# EAGLE design Balloon_Cut-Down (EAGLE 9.2.2)

## Sheet 1 of 2
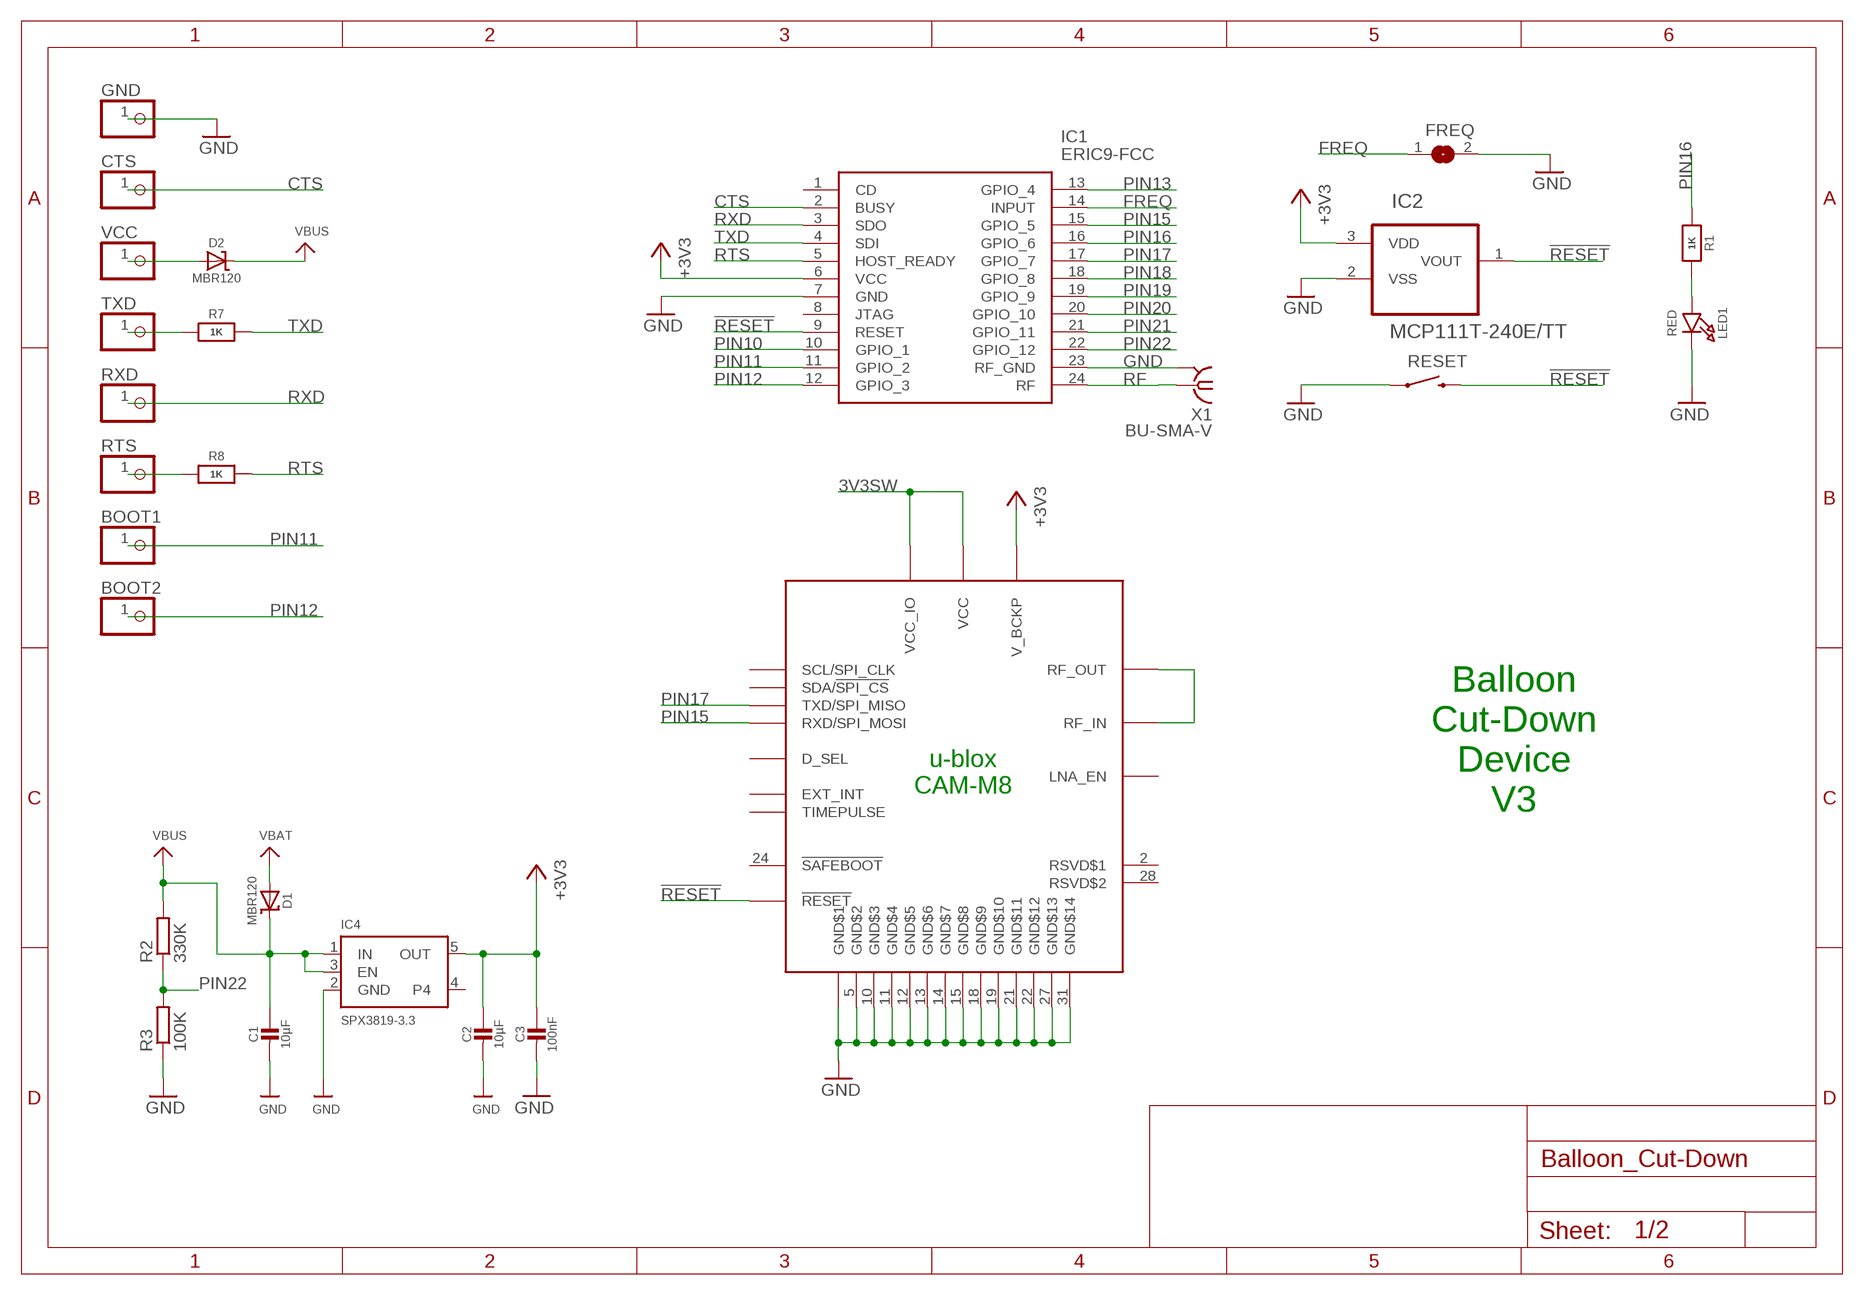
[diagram p0: schematic, sheet 1]

### Parts
BOOT1  PINHD-1X1  [1X01]
BOOT2  PINHD-1X1  [1X01]
C1  10µF  CAP_CERAMIC0805-NOOUTLINE  [0805-NO]
C2  10µF  CAP_CERAMIC0805-NOOUTLINE  [0805-NO]
C3  100nF  CAP_CERAMIC0603_NO  [0603-NO]
CTS  PINHD-1X1  [1X01]
D1  MBR120  DIODE-SCHOTTKYSOD-123  [SOD-123]
D2  MBR120  DIODE-SCHOTTKYSOD-123  [SOD-123]
FREQ  SOLDERJUMPER  [SOLDERJUMPER_ARROW_NOPASTE]
GND  PINHD-1X1  [1X01]
IC1  ERIC9-FCC  [ERIC4]
IC2  MCP111T-240E/TT  MCP111T-270E/TT  [SOT95P237X112-3N]
IC3  CAM-M8  [CAM-M8]
IC4  SPX3819-3.3  VREG_SOT23-5  [SOT23-5]
LED1  RED  LED0805_NOOUTLINE  [CHIPLED_0805_NOOUTLINE]
R1  1K  RESISTOR_0603_NOOUT  [0603-NO]
R2  330K  R-EU_R0603  [R0603]
R3  100K  R-EU_R0603  [R0603]
R7  1K  RESISTOR_0603_NOOUT  [0603-NO]
R8  1K  RESISTOR_0603_NOOUT  [0603-NO]
RESET  SWITCH-MOMENTARY-2PTH  [TACTILE-PTH]
RTS  PINHD-1X1  [1X01]
RXD  PINHD-1X1  [1X01]
TXD  PINHD-1X1  [1X01]
VCC  PINHD-1X1  [1X01]
X1  BU-SMA-V  [BU-SMA-V]

### Nets
3V3SW: IC3.1(VCC_IO) IC3.9(VCC) ; also sheet 2
!RESET: IC1.9(RESET) IC2.1(VOUT) IC3.23(!RESET) RESET.3
+3V3: C2.1 C3.1 IC1.6(VCC) IC2.3(VDD) IC3.8(V_BCKP) IC4.5(OUT) ; also sheet 2
CTS: CTS.1 IC1.2(BUSY) ; also sheet 2
FREQ: FREQ.1 IC1.14(INPUT)
GND: C1.2 C2.2 C3.2 FREQ.2 GND.1 IC1.7(GND) IC1.23(RF_GND) IC2.2(VSS) IC3.4(GND$1) IC3.5(GND$2) IC3.10(GND$3) IC3.11(GND$4) IC3.12(GND$5) IC3.13(GND$6) IC3.14(GND$7) IC3.15(GND$8) IC3.18(GND$9) IC3.19(GND$10) IC3.21(GND$11) IC3.22(GND$12) IC3.27(GND$13) IC3.31(GND$14) IC4.2(GND) LED1.C R3.1 RESET.1 X1.2 X1.3 X1.4 X1.5 ; also sheet 2
N$1: R7.1 TXD.1
N$2: IC3.16(RF_OUT) IC3.17(RF_IN)
N$3: LED1.A R1.2
N$4: R8.1 RTS.1
N$9: D2.A VCC.1
PIN10: IC1.10(GPIO_1) ; also sheet 2
PIN11: BOOT1.1 IC1.11(GPIO_2)
PIN12: BOOT2.1 IC1.12(GPIO_3)
PIN13: IC1.13(GPIO_4) ; also sheet 2
PIN15: IC1.15(GPIO_5) IC3.26(RXD/SPI_MOSI)
PIN16: IC1.16(GPIO_6) R1.1
PIN17: IC1.17(GPIO_7) IC3.25(TXD/SPI_MISO)
PIN18: IC1.18(GPIO_8) ; also sheet 2
PIN19: IC1.19(GPIO_9)
PIN20: IC1.20(GPIO_10)
PIN21: IC1.21(GPIO_11)
PIN22: IC1.22(GPIO_12) R2.1 R3.2
RF: IC1.24(RF) X1.1
RTS: IC1.5(HOST_READY) R8.2 ; also sheet 2
RXD: IC1.3(SDO) RXD.1 ; also sheet 2
TXD: IC1.4(SDI) R7.2 ; also sheet 2
VBAT: D1.A ; also sheet 2
VBUS: C1.1 D1.C D2.C IC4.1(IN) IC4.3(EN) R2.2
Unconnected: IC1.1(CD) IC1.8(JTAG) IC3.2(RSVD$1) IC3.3(SDA/!SPI_CS) IC3.6(SCL/SPI_CLK) IC3.7(EXT_INT) IC3.20(D_SEL) IC3.24(!SAFEBOOT) IC3.28(RSVD$2) IC3.29(TIMEPULSE) IC3.30(LNA_EN) IC4.4

### Notes on the sheet
- u-blox
  CAM-M8
- Balloon
  Cut-Down
  Device
  V3

## Sheet 2 of 2
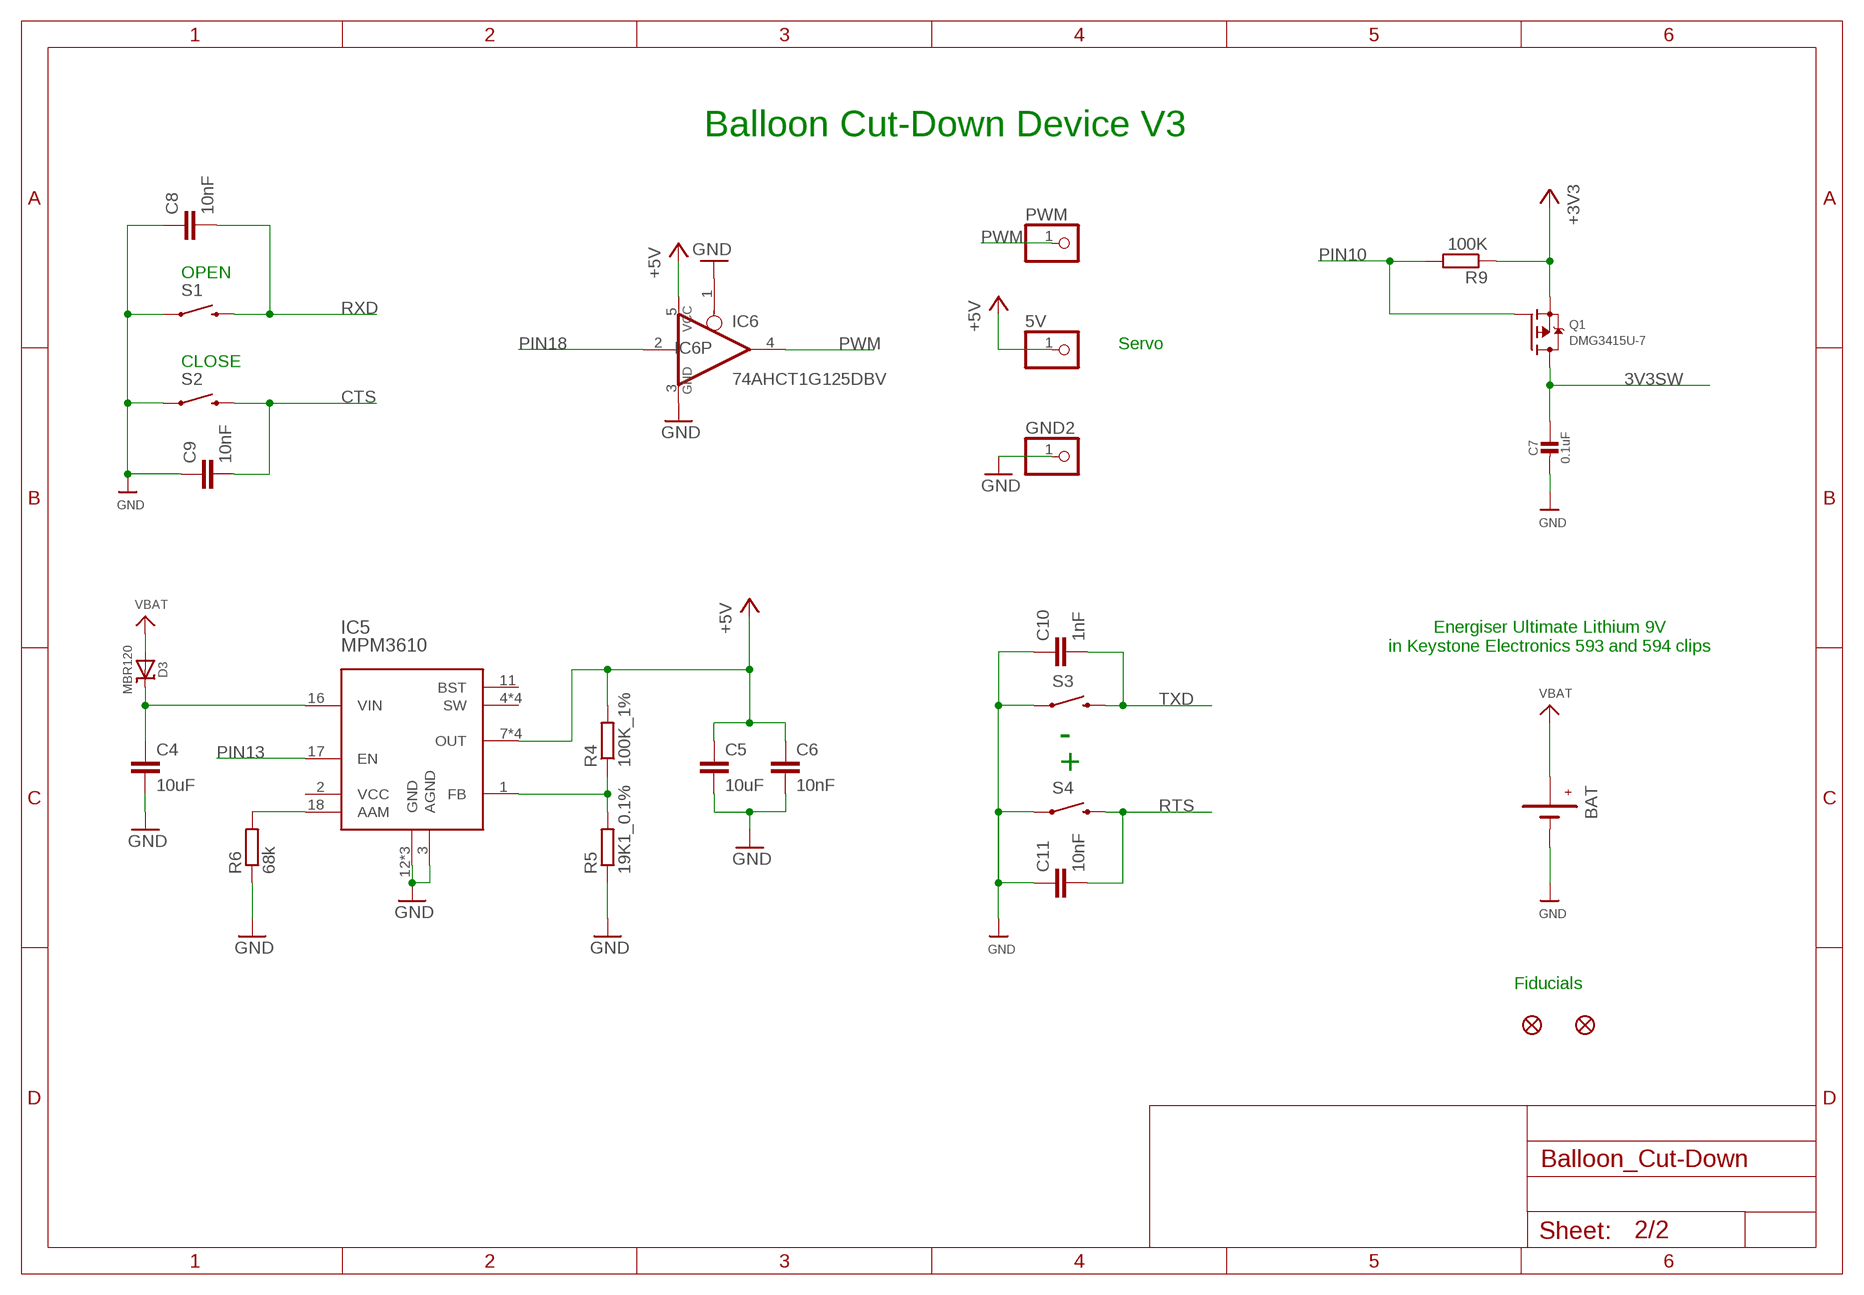
[diagram p1: schematic, sheet 2]

### Parts
5V  PINHD-1X1  [1X01]
BAT  BATTERYBATTERY-9V-KEYSTONE-593-594  [BATTERY-9V-KEYSTONE-593-594]
C4  10uF  C-EUC0805  [C0805]
C5  10uF  C-EUC0805  [C0805]
C6  10nF  C-EUC0805  [C0805]
C7  0.1uF  CAP_CERAMIC0805-NOOUTLINE  [0805-NO]
C8  10nF  C-EUC0805  [C0805]
C9  10nF  C-EUC0805  [C0805]
C10  1nF  C-EUC0805  [C0805]
C11  10nF  C-EUC0805  [C0805]
D3  MBR120  DIODE-SCHOTTKYSOD-123  [SOD-123]
FD1  FIDUCIAL1X2  [FIDUCIAL-1X2]
FD2  FIDUCIAL1X2  [FIDUCIAL-1X2]
GND2  PINHD-1X1  [1X01]
IC5  MPM3610  2093_MPM3610GQV-P  [QFN-20]
IC6  74AHCT1G125DBV  [SOT23-5]
PWM  PINHD-1X1  [1X01]
Q1  DMG3415U-7  MOSFET-PWIDE  [SOT23-WIDE]
R4  100K_1%  R-EU_R0805  [R0805]
R5  19K1_0.1%  R-EU_R0805  [R0805]
R6  68k  R-EU_R0805  [R0805]
R9  100K  R-EU_R0603  [R0603]
S1  SWITCH-MOMENTARY-2PTH  [TACTILE-PTH]
S2  SWITCH-MOMENTARY-2PTH  [TACTILE-PTH]
S3  SWITCH-MOMENTARY-2PTH  [TACTILE-PTH]
S4  SWITCH-MOMENTARY-2PTH  [TACTILE-PTH]

### Nets
3V3SW: C7.1 Q1.3(D) ; also sheet 1
+3V3: Q1.2(S) R9.1 ; also sheet 1
+5V: 5V.1 C5.1 C6.1 IC5.7(OUT) IC5.8(OUT) IC5.9(OUT) IC5.20(OUT) IC6.5(VCC) R4.2
CTS: C9.2 S2.3 ; also sheet 1
GND: BAT.GND1(-) BAT.GND2(-) BAT.GND(-) C4.2 C5.2 C6.2 C7.2 C8.1 C9.1 C10.1 C11.1 GND2.1 IC5.3(AGND) IC5.12(GND) IC5.13(GND) IC5.14(GND) IC6.1(OE) IC6.3(GND) R5.1 R6.1 S1.1 S2.1 S3.1 S4.1 ; also sheet 1
N$6: C4.1 D3.C IC5.16(VIN)
N$26: IC5.1(FB) R4.1 R5.2
N$29: IC5.18(AAM) R6.2
PIN10: Q1.1(G) R9.2 ; also sheet 1
PIN13: IC5.17(EN) ; also sheet 1
PIN18: IC6.2(I) ; also sheet 1
PWM: IC6.4(O) PWM.1
RTS: C11.2 S4.3 ; also sheet 1
RXD: C8.2 S1.3 ; also sheet 1
TXD: C10.2 S3.3 ; also sheet 1
VBAT: BAT.PWR1(+) BAT.PWR2(+) BAT.PWR(+) D3.A ; also sheet 1
Unconnected: IC5.2(VCC) IC5.4(SW) IC5.5(SW) IC5.6(SW) IC5.11(BST) IC5.19(SW)

### Notes on the sheet
- Balloon Cut-Down Device V3
- OPEN
- Servo
- CLOSE
- Energiser Ultimate Lithium 9V
  in Keystone Electronics 593 and 594 clips
- -
- +
- Fiducials

## Library data of the parts
5V BOOT1 BOOT2 CTS GND GND2 PWM RTS RXD TXD VCC = adafruit:PINHD-1X1: Pin header 1x1 for 0.1" spacing With round pins
BAT = SparkFun-Electromechanical:BATTERY: Battery Holders Various common sizes : AA, AAA, 18650 (PRT-12895), 20mm coin cell and 12mm coin cell. 20MM_4LEGS, BATT-10373
C1-C3 C7 = microbuilder:CAP_CERAMIC: Ceramic Capacitors For new designs, use the packages preceded by an '_' character since they are more reliable: The following footprints should be used on most boards: _0402 - Standard footprint for regular board layouts _0603 - Standard footprint for regular board layouts _0805 - Standard footprint for regular board layouts _1206 - Standard footprint for regular board layouts For extremely tight-pitch boards where space is at a premium, the following 'micro-pitch' footprints can be used (smaller pads, no silkscreen outline, etc.): _0402MP - Micro-pitch footprint for very dense/compact boards _0603MP - Micro-pitch footprint for very dense/compact boards _0805MP - Micro-pitch footprint for very dense/compact boards _1206MP - Micro-pitch footprint for very dense/compact boards
C4-C6 C8-C11 = rcl:C-EU: CAPACITOR, European symbol; SPICEPREFIX: C
D1-D3 = microbuilder:DIODE-SCHOTTKY
FD1 FD2 = SparkFun-Aesthetics:FIDUCIAL: Fiducial Alignment Points Various fiducial points for machine vision alignment.
FREQ = microbuilder:SOLDERJUMPER: SMD Solder JUMPER Solder the two pads together to create a connection, or remove the solder to break it. REFLOW - Use this footprint for solder paste and reflow ovens. WAVE - Use this footprint for hand-soldering (larger pads). CLOSED - Has a trace between the two pads to ensure it is closed by default. The trace needs to be cut to disable the jumper, and can be closed again by creating a solder bridge between the two pads.; BOM: EXCLUDE
IC1 = SamacSys_Parts:ERIC9-FCC: RF Modules Euro/US 868/915MHz Int Cont Trans RFMod Source: Datasheet <https://componentsearchengine.com/Datasheets/1/eRIC9-FCC.pdf>; ARROW_PART_NUMBER: eRIC9-FCC; DESCRIPTION: RF Modules Euro/US 868/915MHz Int Cont Trans RFMod; HEIGHT: mm; MANUFACTURER_NAME: LPRS; MANUFACTURER_PART_NUMBER: eRIC9-FCC
IC2 = Microchip-MCP11:MCP11: Micropower Voltage Detector ,SOT23-3;; MPN: MCP111T-240E/TT; OC_FARNELL: 1851877; OC_NEWARK: 56J7328; PACKAGE: SOT23-3; SUPPLIER: MICROCHIP
IC3 = ubloxLib:CAM-M8: CAM-M8x: M8 Concurrent GNSS Antenna Module u-blox.com
IC4 = microbuilder:VREG_SOT23-5: SOT23-5 Fixed Voltage Regulators Part Current Out V Out V In V Dropout θJA (°C/W) TJ (°C) Digikey Part No. ADP121 150mA 3.3V 3.4-5.5V 0.09V @ 150mA -- -- ADP121-AUJZ33R7CT-ND ADP121 150mA 3.0V 3.1-5.5V 0.09V @ 150mA -- -- ADP121-AUJZ30R7CT-ND ADP122 300mA 3.3V 3.4-5.5V 0.085V @ 300mA -- -- ADP122AUJZ-3.3-R7CT-ND ADP1712 300mA 3.3V 3.5-5.5V 0.17V @ 300mA -- -- ADP1712AUJZ-3.3-R7TR-ND AP7311 (Low Cost) 150mA 3.3V 3.5-6V 0.15V @ 150mA -- -- AP7311-33WG-7DICT-ND LD39015M18R 150mA 1.8V 1.9V-5.5V 0.08V @ 100mA -- -- 497-6977-1-ND LP2985A-33DBVR 150mA 3.3V 3.3-16V 0.28V @ 150mA 206 150 296-18479-1-ND MCP1824T-3302E/OT 300mA 3.3V 3.5V-6V 0.2V @ 300mA -- -- MCP1824T-3302E/OTCT-ND MIC5205-2.5YM5 TR 150mA 2.5V 2.7-16V 0.165V @ 150mA -- -- 576-1257-2-ND MIC5205-3.0YM5 TR 150mA 3.0V 3.2V-16V 0.165V @ 150mA -- -- 576-1258-2-ND MIC5205-3.3YM5 TR 150mA 3.3V 3.5V-16V 0.165V @ 150mA -- -- 576-1259-2-ND TPS780330220 150mA 3.3V+2.2V 3.6-5.5V 250mV Max -- -- 296-23332-1-ND TDA3663/N1,135 100mA 3.3V 3.5-45V 0.18V @ 50mA -- -- 568-5343-1-ND Max operating temp can be calculated using θJA, TJ (max junction temperature), and power in watts. Set the "Maximum Ambient Temperature" until it reaches TJ ("Max Junction Temperature"), which is the absolute limit for safe use of the regulator: Heat Sink Temperature Calculator <http://www.daycounter.com/Calculators/Heat-Sink-Temperature-Calculator.phtml> For example, With 12V source into a 3.3V LP2985 and a 30mA load, we are dissipating (12V-3.3V) * 0.03A = 0.261W. With a θJA of 206 °C/W, a TJ of 150°C, and 261mW we can safely use the chip without a heat sink up to 75°C (=147.1°C Junction Temperature).
IC5 = IntegratedCircuits:2093_MPM3610GQV-P: MPM3610 Step Down Regulator; CASE: QFN-20; PART_NUMBER: MPM3610GQV-P; TYPE: Circuito_Integrato
IC6 = 74xx-little-us:74*1G125: Single Bus Buffer Gate with 3-State Output
LED1 = microbuilder:LED: LED 0603 - 0603 Surface Mount Package 2mA: Green LED - Low Power (3.9mcd, 2ma, 1.7Vf) - Digikey: 475-2709-2-ND Orange LED - Low Power (9.8mcd, 2ma, 1.8Vf) - Digikey: 475-1194-2-ND Red LED - Low Power (5mcd, 2ma, 1.8Vf) - Digikey: 475-1195-2-ND Yellow LED - Low Power (7mcd, 2ma, 1.8Vf) - Digikey: 475-1196-2-ND 5mA: Blue LED - Low Power (17mcd, 5ma, 2.9Vf) - Digikey: LNJ937W8CRACT-ND 0805 - 0805 Surface Mount Package 2mA: Red LED (8.8mcd, 2mA, 1.8Vf, Clear) - Low Power [Digikey: 475-2510-1-ND] Green LED (5mcd, 2mA, 1.8Vf, Clear) - Low Power [Digikey: 475-2730-1-ND] Yellow LED (11.3mcd, 2mA, 1.8Vf, Clear) - Low Power [Digikey: 475-2555-1-ND] 20mA: Red LED (104mcd, 20mA, Diffused) - LS R976 [Digikey: 475-1278-6-ND] Red LED (12mcd, 20mA, 2.0Vf, Clear) - APT2012EC [Digikey: 754-1128-1-ND] Green LED (15mcd, 20mA, 2.2Vf, Clear) - APT2012GC [Digikey: 754-1131-1-ND] Orange LED (160mcd, 20mA, 2.1Vf, Clear) - APT2012SECK [Digikey: 754-1130-1-ND] 1206 - 1206 Surface Mount Package Green LED (26mcd, 20mA, Diffused) - LG N971 [Digikey: 475-1407-6-ND] Red LED (15mcd, 20mA, Diffused) - LH N974 [Digikey: 475-1416-6-ND] Cree - Cree High-Power Surface Mount LEDs XPEBWT-L1-0000-00D50 - White 111lm 350mA 2.9Vf 6200K 110° XTEAWT-00-0000-00000LEE3 - White 114lm 350mA 2.85Vf 5000K 115° Everlight - Everlight 45-21 Series Surface Mount LEDs 45-21/QK2C-B2832AC2CB2/2T - Warm White 2000mcd 20mA 3.25Vf 3050K 120° 45-21/LK2C-B38452C4CB2/2T - Nuetral White 2000mcd 20mA 3.25Vf 4150K 120° 45-21/LK2C-B50634C6CB2/2T - Cold White 2200mcd 20mA 3.25Vf 5650K 120° PLCC2 Reverse Mount LS T77K-J1L2-1-0-2-R18-Z - Red 11.25mcd 2mA 1.8Vf 630nm 120° LO T77K-L1M2-24-Z - Orange 19.6mcd 2mA 1.8Vf 606nm 120° LY T77K-K2M1-26-Z - Yellow 15.7mcd 2mA 1.8Vf 587nm 120°
Q1 = microbuilder:MOSFET-P: P-Channel Mosfet LEGEND VDS: Voltage Drain-Source ID: Drain Current RDS(ON): Drain-Source On-State Resistance VGS(TH): Gate-Source Threshold Voltage CISS: Drain-Source Input Capacitance SOT-23 Name VDS ID RDS(ON) VGS(TH) CISS Order Number IRLML5103 30V 760mA 600 mOhm -- 75pF @ 25V Digikey: IRLML5103PBFCT-ND IRLML6401 12V 4.3A 50 mOhm 950mV @ 250µA 830pF @ 10V Digikey: IRLML6401PBFTR-ND NTR0202PL 20V 400mA 800 mOhm 2.3V @ 250uA 70pF @ 5V Digikey: NTR0202PLT1GOSTR-ND NTR4101PT1G 20V 1.8A 85 mOhm 1.2V @ 250uA 675pF @ 10V Digikey: NTR4101PT1GOSCT-ND DMP2004K 20V 600mA 900 mOhm 1V @ 250uA 175pF @ 16V Digikey: DMP2004KDICT-ND PMV65XP 20V 3.9A 76 mOhm 950mV @ 1mA 725pF @ 20V Digikey: 568-2358-2-ND TO-252 Name VDS ID RDS(ON) VGS(TH) CISS Order Number AOD417 30V 25A 34 mOhm 3V @ 250µA 920pF @ 15V Digikey: 785-1106-2-ND
R1 R7 R8 = microbuilder:RESISTOR: Resistors For new designs, use the packages preceded by an '_' character since they are more reliable: The following footprints should be used on most boards: _0402 - Standard footprint for regular board layouts _0603 - Standard footprint for regular board layouts _0805 - Standard footprint for regular board layouts _1206 - Standard footprint for regular board layouts For extremely tight-pitch boards where space is at a premium, the following 'micro-pitch' footprints can be used (smaller pads, no silkscreen outline, etc.): _0402MP - Micro-pitch footprint for very dense/compact boards _0603MP - Micro-pitch footprint for very dense/compact boards _0805MP - Micro-pitch footprint for very dense/compact boards _1206MP - Micro-pitch footprint for very dense/compact boards
R2-R6 R9 = rcl:R-EU_: RESISTOR, European symbol; SPICEPREFIX: R
RESET S1-S4 = SparkFun-Electromechanical:SWITCH-MOMENTARY-2: Various NO switches- pushbuttons, reed, etc; PROD_ID: SWCH-08441
X1 = con-coax:BU-SMA-V: FEMALE SMA CONNECTOR Radiall distributor RS 112-3794; OC_FARNELL: unknown; OC_NEWARK: unknown

## Net classes
2 gnd: width 0.254 mm, drill 0.254 mm, clearance 0.178 mm
3 usbvcc: width 0.203 mm, drill 0.406 mm, clearance 0.178 mm

## Board
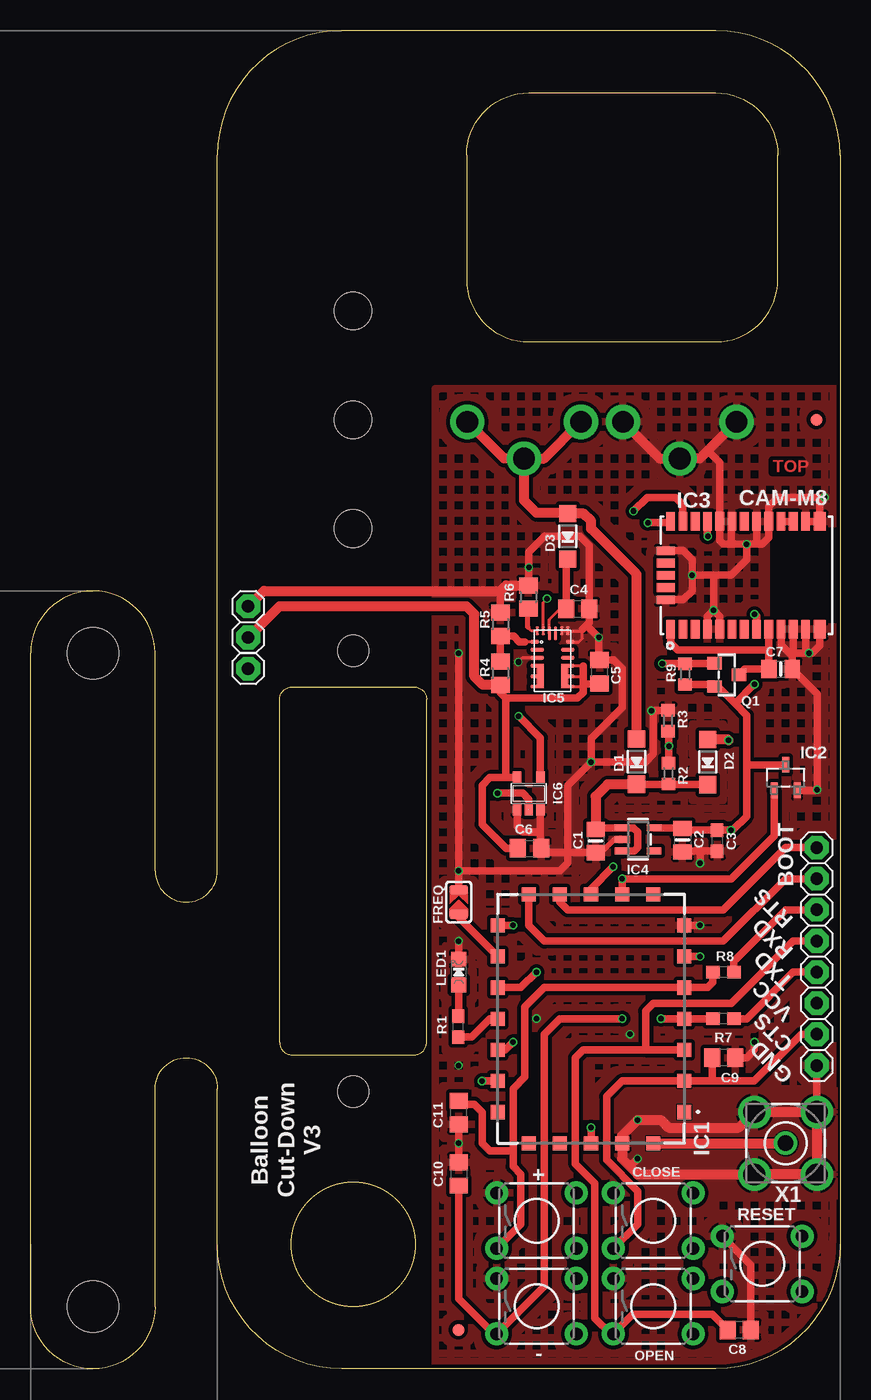
[diagram p2: board, top side]
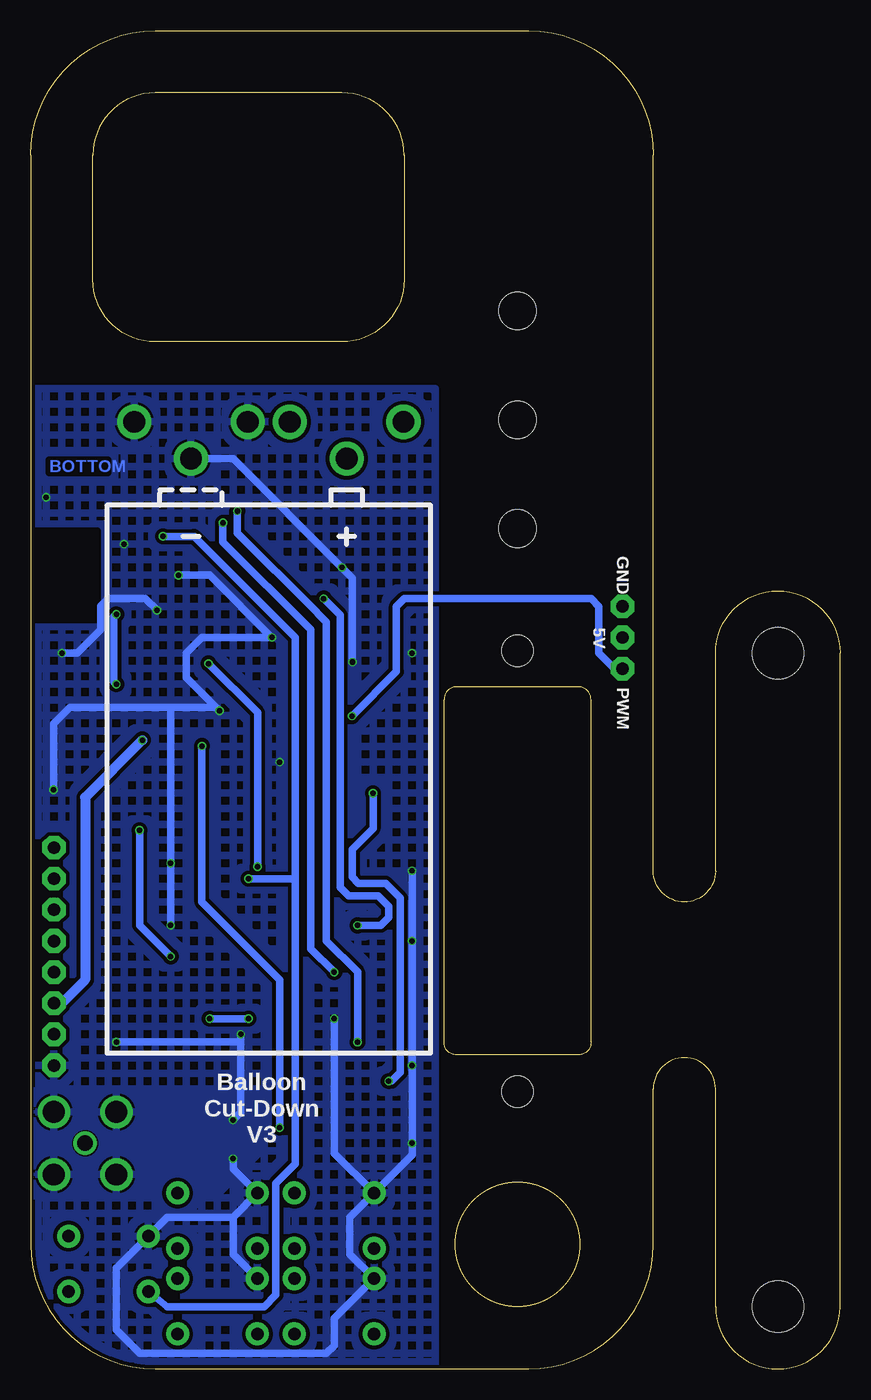
[diagram p3: board, bottom side, seen from below]

Size 66.04 x 109.22 mm. Coordinates in mm from the lower left corner, seen from the top.
Outline: 66.04,99.06 arc90 55.88,109.22 25.4,109.22 arc90 15.24,99.06 15.24,40.64 arc-180 10.16,40.64 10.16,58.42 arc180 0,58.42 0,5.08 arc180 10.16,5.08 10.16,22.86 arc-180 15.24,22.86 15.24,10.16 arc90 25.4,0 55.88,0 arc90 66.04,10.16 66.04,99.06
Outline: 20.32,26.64 20.32,54.63 arc-90 21.31,55.65 31.32,55.65 arc-90 32.31,54.63 32.31,26.64 arc-90 31.32,25.63 21.31,25.63 arc-90 20.32,26.64
Outline: 55.88,104.14 arc-90 60.96,99.06 60.96,88.9 arc-90 55.88,83.82 40.64,83.82 arc-90 35.56,88.9 35.56,99.06 arc-90 40.64,104.14 55.88,104.14
Outline: circle at 26.31,10.16 radius 5.08
Copper layers (1*16): Top 0.018mm / dielectric 1.55mm / Bottom 0.018mm
Design rules "Multi-CB_2L_100um-Tracks_OL35um *": minimum track width 0.1mm, minimum drill 0.2mm, track to track 0.1mm, track to pad 0.1mm, pad to pad 0.1mm, via to via 0.1mm, smd to smd 0mil, copper to edge 0.2mm, drill to drill 0.2mm, minimum pad ring 0.125mm, minimum via ring 0.1mm, stop-mask expansion 2mil, vias tented up to drill 0.45mm, thermal gap 0.2mm
Holes 2.54 mm at 26.31,22.63 26.31,58.6
Holes 3.05 mm at 26.31,86.36 26.31,77.47 26.31,68.58
Holes 4.19 mm at 5.08,5.08 5.08,58.42

### Footprints (pad centres in the part's own frame; a part is rotated, then mirrored left to right if it is on the bottom)
1X01 = drill 1.016 pad 1.93 octagon: 1 0,0
BATTERY-9V-KEYSTONE-593-594 = drill 1.778 pad 2.794: GND 0,-6.35; GND1 -2.997,-1.714; GND2 -2.997,-10.986; PWR 0,6.35; PWR1 -2.997,10.986; PWR2 -2.997,1.714
0805-NO = smd 1.24 x 1.5: 1 -0.95,0; 2 0.95,0
0603-NO = smd 1.1 x 1: 1 -0.85,0; 2 0.85,0
C0805 = smd 1.3 x 1.5: 1 -0.95,0; 2 0.95,0
SOD-123 = smd 1.4 x 1.4: A 1.85,0; C -1.85,0
FIDUCIAL-1X2 = smd 1 x 1: 1 0,0
SOLDERJUMPER_ARROW_NOPASTE = smd 0.762 x 1.524: 1 -1.016,0; 2 1.016,0
ERIC4 = smd 1.15 x 1.15: 1 -7.62,-7.62; 2 -5.08,-7.62; 3 -2.54,-7.62; 4 0,-7.62; 5 2.54,-7.62; 6 5.08,-7.62; 7 7.62,-7.62; 8 10.16,-5.08; 9 10.16,-2.54; 10 10.16,0; 11 10.16,2.54; 12 10.16,5.08; 13 7.62,7.62; 14 5.08,7.62; 15 2.54,7.62; 16 0,7.62; 17 -2.54,7.62; 18 -5.08,7.62; 19 -7.62,7.62; 20 -10.16,5.08; 21 -10.16,2.54; 22 -10.16,0; 23 -10.16,-2.54; 24 -10.16,-5.08
SOT95P237X112-3N = smd 0.559 x 1.27: 1 -0.94,-1.041; 2 0.94,-1.041; 3 0,1.041
CAM-M8 = smd 0.7 x 1.5: 1 -6.2,-4.4; 2 -5.2,-4.4; 3 -4.2,-4.4; 4 -3.2,-4.4; 5 -2.2,-4.4; 6 -1.2,-4.4; 7 -0.2,-4.4; 8 0.8,-4.4; 9 1.8,-4.4; 10 2.8,-4.4; 11 3.8,-4.4; 12 4.8,-4.4; 15 4.8,4.4; 16 3.8,4.4; 17 2.8,4.4; 18 1.8,4.4; 19 0.8,4.4; 20 -0.2,4.4; 21 -1.2,4.4; 22 -2.2,4.4; 23 -3.2,4.4; 24 -4.2,4.4; 25 -5.2,4.4; 26 -6.2,4.4 | smd 1 x 1.5: 13 5.95,-4.4; 14 5.95,4.4 | smd 1.5 x 0.7: 27 -6.6,2; 28 -6.6,1; 29 -6.6,0; 30 -6.6,-1; 31 -6.6,-2
SOT23-5 = smd 0.55 x 1.2: 1 -0.95,-1.3; 2 0,-1.3; 3 0.95,-1.3; 4 0.95,1.3; 5 -0.95,1.3
QFN-20 = smd 0.7 x 0.25: 1 -1.45,1.55; 4 -1.45,-0.4; 5 -1.45,-1.25; 6 -1.45,-2.1; 7 1.45,-2.1; 8 1.45,-1.25; 9 1.45,-0.4; 12 1.45,1.55 | smd 1.1 x 0.25: 2 -1.25,0.9; 3 -1.25,0.25; 10 1.25,0.25; 11 1.25,0.9 | smd 0.25 x 0.7: 13 1.25,2.45; 14 0.75,2.45; 17 -0.75,2.45; 18 -1.25,2.45 | smd 0.25 x 1.1: 15 0.25,2.25; 16 -0.25,2.25 | smd 0.6 x 1.95: 19 -1,-1.25; 20 1,-1.25
SOT23-5' = smd 0.69 x 0.99: 1 -0.95,-1.29; 2 0,-1.29; 3 0.95,-1.29; 4 0.95,1.3; 5 -0.95,1.3
CHIPLED_0805_NOOUTLINE = smd 1.2 x 1.2: A 0,-1.05; C 0,1.05
SOT23-WIDE = smd 1 x 1.2: 1 -0.95,-1; 2 0.95,-1; 3 0,1
R0603 = smd 1 x 1.1: 1 -0.85,0; 2 0.85,0
R0805 = smd 1.3 x 1.5: 1 -0.95,0; 2 0.95,0
TACTILE-PTH = drill 1.016 pad 1.88: 1 -3.251,2.261; 2 3.251,2.261; 3 -3.251,-2.261; 4 3.251,-2.261
BU-SMA-V = drill 1.27: 1 0,0 | drill 1.778: 2 -2.55,2.55; 3 2.55,2.55; 4 2.55,-2.55; 5 -2.55,-2.55

### Placement (x,y rotation side)
5V  17.75,59.69 90 top
BAT  46.61,74.3 270 bottom
BOOT1  64.14,42.55 90 top
BOOT2  64.14,40.01 90 top
C1  46.1,43.08 270 top
C2  53.18,43.15 270 top
C3  56.01,43.12 270 top
C4  44.64,62.04 0 top
C5  46.42,56.9 90 top
C6  40.7,42.48 0 top
C7  61.18,57.12 0 top
C8  57.82,3.17 180 top
C9  56.55,25.4 180 top
C10  34.92,15.91 270 top
C11  34.92,20.92 90 top
CTS  64.14,27.3 90 top
D1  49.43,49.56 90 top
D2  55.24,49.53 90 top
D3  43.81,67.94 90 top
FD1  34.89,3.17 0 top
FD2  64.1,77.47 0 top
FREQ  34.92,38.1 90 top
GND  64.14,24.77 90 top
GND2  17.75,62.23 90 top
IC1  45.72,28.57 90 top
IC2  61.59,48.26 0 top
IC3  58.42,64.77 0 top
IC4  49.56,43.21 270 top
IC5  42.58,57.78 0 top
IC6  74AHCT1G125DBV  [SOT23-5']  40.64,46.96 0 top
LED1  34.92,32.38 0 top
PWM  17.75,57.15 270 top
Q1  56.8,56.64 270 top
R1  34.89,27.94 90 top
R2  52.04,48.58 270 top
R3  52.01,52.9 270 top
R4  38.32,56.77 270 top
R5  38.32,60.77 270 top
R6  40.61,62.99 270 top
R7  56.52,28.57 180 top
R8  56.52,32.38 180 top
R9  53.4,56.71 90 top
RESET  59.69,8.57 0 top
RTS  64.14,37.47 90 top
RXD  64.14,34.92 90 top
S1  50.8,5.11 0 top
S2  50.8,12.1 0 top
S3  41.27,5.11 0 top
S4  41.27,12.1 0 top
TXD  64.14,32.38 90 top
VCC  64.14,29.84 90 top
X1  61.59,18.41 0 top

### Tracks (layer width: path | path; a pad name or v marks a point on that pad's centre or on a via)
3V3SW
  Top 0.61: Q1.3 58.28,57.12 C7.1 60.23,58.67 | 60.23,58.67 60.23,60.36 IC3.9 | IC3.1 52.22,59.25 52.8,58.67 60.23,58.67
!RESET  (via drill 0.45)
  Top 0.61: IC2.1 60.66,43.51 57.15,40.01 48.9,40.01 v48.26,40.01 IC1.9 | IC3.23 55.22,67.97 v55.24,67.94
  Bottom 0.61: RESET.3 54.89,5.08 46.99,5.08 46.04,6.03 46.04,15.14 44.45,16.73 44.45,40.01 | 44.45,40.01 44.45,59.69 52.7,67.94 v55.24,67.94 | v48.26,40.01 44.45,40.01
+3V3  (via drill 0.45)
  Top 0.61: R9.1 55.64,55.85 Q1.2 56.07,55.69 57.47,54.29 | IC4.5 53.12,44.16 53.21,44.07 C2.1 53.31,43.97 C3.1 v57.15,43.97 57.3,43.97 58.42,45.09 58.42,49.28 | 58.42,49.28 58.42,53.34 57.47,54.29 | IC2.3 58.45,49.3 58.42,49.28 | IC1.6 v54.61,33.66 | IC3.8 59.22,61.43 v59.05,61.59 | v59.05,55.88 57.47,54.29
  Bottom 0.61: v54.61,33.66 57.15,36.2 v57.15,43.97 | v59.05,61.59 59.24,61.4 59.24,56.07 v59.05,55.88
+5V
  Top 0.203: IC5.8 IC5.20
  Top 0.254: IC5.9 45.07,57.38 45.09,57.37 | IC5.8 44.05,56.52 45.09,56.52 | IC5.7 44.96,55.69 45.09,55.56
  Top 0.61: 45.09,57.37 45.09,56.52 45.09,55.88 | 45.09,55.88 45.09,55.56 45.09,55.21 44.61,54.74 44.45,54.74 38.77,54.74 | 38.77,54.74 38.32,55.18 R4.2 | C5.1 46.35,55.88 45.09,55.88 | IC6.5 38.73,48.26 | 38.73,48.26 37.46,48.26 36.83,47.62 36.83,44.45 38.8,42.48 C6.1 | 38.77,54.74 38.77,48.29 38.73,48.26
  Top 0.813: 5V.1 20.29,62.23 35.56,62.23 36.2,61.59 36.2,56.52 36.89,55.82 R4.2
CTS
  Top 0.61: CTS.1 62.87,27.3 59.05,23.5 55.63,23.5 | 55.63,23.5 IC1.2 48.26,23.5 46.99,22.23 46.99,17.05 49.53,14.51 49.53,11.82 S2.3 | C9.2 55.6,23.52 55.63,23.5
FREQ
  Top 0.61: IC1.14 34.92,36.83 FREQ.1
GND  (via drill 0.45)
  Top 0.254: IC5.14 IC5.13 44.93,60.23 45.02,60.33 45.02,59.63 44.73,59.34 IC5.12 | IC5.3 40.13,58.03 v39.78,57.69
  Top 0.406: C1.2 46.55,42.13 47.62,43.21 IC4.2
  Top 0.61: C2.2 53.21,42.17 53.31,42.27 54.61,42.27 | IC3.13 64.37,59.04 63.75,58.42 v63.5,58.42 63.28,58.42 | IC3.10 61.22,59.08 61.88,58.42 62.23,58.42 | 63.28,58.42 62.23,58.42 | IC3.11 62.23,58.42 | IC3.12 63.22,58.48 63.28,58.42 | 62.23,58.42 62.13,58.32 C7.2 64.17,55.08 v64.17,47.28 64.22,47.22 IC2.2 | v55.72,61.91 55.22,61.41 IC3.4 | v55.72,61.91 56.22,61.41 IC3.5 | FREQ.2 v34.92,40.64 | IC1.7 v54.61,36.2 | 38.32,63.5 R5.1 | 45.02,60.33 45.39,60.69 | 45.39,60.69 45.59,60.89 C4.2 45.59,67.19 44.8,67.98 41.94,67.98 40.64,66.67 v40.64,65.41 40.64,63.97 R6.1 | IC6.3 41.59,43.81 | 41.59,43.81 41.59,42.55 C6.2 42,42.13 43.81,42.13 | C1.2 43.81,42.13 | C3.2 54.61,42.27 | v54.61,41.27 54.61,42.27 | v49.53,17.14 48.9,16.51 | v59.05,26.67 59.05,26.04 58.42,25.4 C9.1 | v34.92,34.92 LED1.C | IC3.15 IC3.14 64.37,70.72 v64.77,71.12 60.96,71.12 60.22,70.38 IC3.18 60.22,67.84 59.69,67.31 59.05,67.31 | 57.15,67.31 56.52,67.31 56.22,67.61 IC3.22 56.22,73.95 55.24,74.94 | 57.15,67.31 v58.42,67.31 | 59.05,67.31 v58.42,67.31 | IC3.21 57.15,69.1 57.15,67.31 | IC3.19 59.22,67.47 59.05,67.31 | IC3.27 53.24,66.77 53.98,66.04 v53.98,64.77 | IC3.31 53.24,62.77 53.98,63.5 v53.98,64.77 | IC6.1 39.69,44.26 40.13,43.81 41.59,43.81 | v53.98,64.77 55.88,64.77 | 55.88,64.77 57.15,64.77 58.42,66.04 v58.42,67.31 | v55.72,61.91 55.72,64.61 55.88,64.77 | R3.1 50.67,53.74 | 50.67,53.74 v50.64,53.72 | 45.39,60.69 45.39,60.66 v46.35,59.69 46.35,57.91 C5.2 47.56,57.85 48.26,57.15 48.26,53.98 45.72,51.44 v45.72,49.53 | 50.67,53.74 50.8,53.61 50.8,50.16 50.16,49.53 v45.72,49.53 | v34.92,40.64 v34.92,58.42 | v34.92,40.64 43.18,40.64 43.81,41.27 43.81,42.13
  Top 0.61: GND.1 64.14,24.75 X1.3 | 43.81,42.13 43.81,47.62 v45.72,49.53 | C10.1 v34.92,18.41 C11.1 | C8.1 58.77,8.51 RESET.1
  Top 0.813: 59.03,15.88 X1.5 | 59.03,15.88 49.53,15.88 48.9,16.51 48.26,17.14 IC1.23 48.26,19.05 v49.53,20.32 51.44,20.32 52.07,19.68 57.77,19.68 X1.2 X1.3 X1.4 59.03,15.88 | BAT.GND1 51.32,74.3 BAT.GND 54.6,74.3 55.24,74.94 BAT.GND2 | GND2.1 19.02,63.5 38.32,63.5 38.76,63.94 R6.1
  Bottom 0.61: BAT.GND 49.53,74.3 v40.64,65.41 39.78,64.55 v39.78,57.69 | v53.98,64.77 51.44,64.77 v46.35,59.69 52.07,59.69 53.34,58.42 53.34,56.42 v50.64,53.72 50.9,53.98 54.61,53.98 | v55.72,61.91 56.67,62.87 59.69,62.87 60.31,62.24 60.31,60.34 62.23,58.42 v63.5,58.42 | v64.17,47.28 64.17,52.67 62.87,53.98 54.61,53.98 | v54.61,36.2 v54.61,41.27 54.61,53.98 | v34.92,40.64 v34.92,34.92 v34.92,24.77 v34.92,18.41 34.92,17.46 S4.1 | v41.27,28.57 41.27,17.61 S4.1 | v48.9,27.3 48.9,26.67 | 48.9,26.67 48.9,20.95 v49.53,20.32 | v49.53,17.14 49.53,16.34 S2.1 49.53,12.38 | v59.05,26.67 48.9,26.67 | S1.1 49.53,9.35 49.53,12.38 | S4.1 40.01,12.38 40.01,9.35 S3.1 41.27,4.12 41.27,1.91 41.91,1.27 57.15,1.27 59.05,3.17 59.05,8.26 59.02,8.26 RESET.1 54.9,12.38 49.53,12.38
  pour Top (isolate 0.305, rank 2, hatched): 33.02,0 33.02,80.01 66.04,80.01 66.04,0
  pour Bottom (isolate 0.305, rank 2, hatched): 33.02,0 33.02,80.01 66.04,80.01 66.04,0
  pour Bottom (isolate 0.102): 66.04,22.86 66.04,13.97 56.52,13.97 54.61,15.88 53.34,15.88 51.44,13.97 50.8,13.97 46.99,17.78 46.99,18.41 46.99,22.23 47.62,22.86 48.26,22.86
  pour Top (isolate 0.102): 66.04,22.86 66.04,13.97 56.52,13.97 54.61,15.88 53.34,15.88 51.44,13.97 51.12,13.97 48.77,16.32 47.72,17.37 47.72,22 48.51,22.8 48.58,22.8 48.64,22.86
N$1
  Top 0.61: TXD.1 62.23,32.38 58.42,28.57 R7.1
N$2
  Top 0.61: IC3.16 IC3.17
N$3
  Top 0.61: LED1.A 34.92,28.82 R1.2
N$4
  Top 0.61: R8.1 57.37,33.23 61.59,37.47 RTS.1
N$6
  Top 0.254: IC5.16 42.33,61.15 43.21,62.04 C4.1
  Top 0.61: C4.1 43.69,65.97 D3.C
N$9  (via drill 0.45)
  Top 0.813: D2.A 56.86,51.38 v56.93,51.31
  Bottom 0.813: VCC.1 63.5,29.84 61.59,31.75 61.59,46.64 v56.93,51.31
N$26
  Top 0.254: IC5.1 40.33,59.34
  Top 0.61: R4.1 R5.2 39.4,59.82 39.88,59.34 40.33,59.34
N$29
  Top 0.254: IC5.18 40.86,60.23 40.58,60.52
  Top 0.406: 40.58,60.52 40.58,62.01 R6.2
PIN10  (via drill 0.45)
  Top 0.61: Q1.1 55.76,57.56 R9.2 v51.54,57.56 v51.53,57.56 | IC1.10 45.72,39.18 v47.53,40.99
  Bottom 0.61: v47.53,40.99 47.53,53.56 v51.53,57.56
PIN11
  Top 0.61: BOOT1.1 61.59,42.55 56.52,37.47 43.81,37.47 43.18,38.1 IC1.11
PIN12
  Top 0.61: BOOT2.1 61.59,40.01 56.52,34.92 41.91,34.92 40.64,36.2 IC1.12
PIN13  (via drill 0.45)
  Top 0.254: IC5.17 41.83,62.56 v42.13,62.87
  Top 0.61: IC1.13 v39.37,36.2
  Bottom 0.61: v42.13,62.87 40.8,61.53 40.8,39.31 40.1,38.61 37.69,38.61 36.83,37.75 36.83,36.83 37.47,36.2 v39.37,36.2
PIN15  (via drill 0.45)
  Top 0.61: v50.35,69.06 52.11,69.06 IC3.26 | IC1.15 40.01,31.11 v41.27,32.38
  Bottom 0.61: v50.35,69.06 50.35,67.5 43.18,60.33 43.18,34.29 v41.27,32.38
PIN16
  Top 0.61: R1.1 35.98,27.09 37.47,28.57 IC1.16
PIN17  (via drill 0.45)
  Top 0.61: v49.18,70.01 50.29,71.12 52.64,71.12 53.22,70.54 IC3.25 | v39.37,26.67 38.73,26.04 IC1.17
  Bottom 0.61: v49.18,70.01 49.18,68.23 42.88,61.92 42.44,61.49 41.91,60.96 41.91,34.92 39.37,32.38 v39.37,26.67
PIN18  (via drill 0.45)
  Top 0.61: IC1.18 v36.83,23.5 | IC6.2 40.64,46.48 40.13,46.99 v38.1,46.99
  Bottom 0.61: v36.83,23.5 36.58,23.5 35.88,24.19 35.88,38.42 37.08,39.62 39.31,39.62 39.81,40.13 39.81,42.39 38.1,44.1 v38.1,46.99
PIN22  (via drill 0.45)
  Top 0.61: IC1.22 v45.72,19.68 | R2.1 52.07,49.46 v52.07,50.83 52.07,51.98 R3.2
  Bottom 0.61: v45.72,19.68 45.72,31.75 52.07,38.1 v52.07,50.83
PWM  (via drill 0.45)
  Top 0.61: v39.81,53.28 41.59,51.5 IC6.4
  Bottom 0.61: v39.81,53.28 36.2,56.9 36.2,62.23 35.56,62.87 20.32,62.87 19.68,62.23 19.68,58.42 18.41,57.15 PWM.1
RF
  Top 0.813: IC1.24 X1.1
RTS
  Top 0.61: R8.2 55.66,31.54 55.24,31.11 IC1.5 41.91,31.11 40.32,29.53 40.32,23.81 39.37,22.86 39.37,22.23 39.37,17.78 | 39.37,17.78 39.37,16.51 40.01,15.88 40.01,11.82 S4.3 | C11.2 35.21,21.59 36.2,21.59 36.83,20.95 36.83,18.41 37.47,17.78 39.37,17.78
RXD
  Top 0.61: RXD.1 62.23,34.92 57.15,29.84 50.8,29.84 50.16,29.21 50.16,26.04 | 50.16,26.04 IC1.3 | C8.2 55.6,4.45 49.14,4.45 S1.3 47.31,2.85 46.04,4.13 46.04,15.16 44.45,16.75 44.45,25.4 45.09,26.04 50.16,26.04
TXD  (via drill 0.45)
  Top 0.61: R7.2 IC1.4 v51.44,28.57 | v48.26,28.57 43.18,28.57 41.91,27.3 41.91,6.74 S3.3 37.79,2.85 34.92,5.71 C10.2
  Bottom 0.61: v51.44,28.57 v48.26,28.57
VBAT
  Top 0.813: BAT.PWR 41.9,74.3 BAT.PWR2 | BAT.PWR 38.62,74.3 BAT.PWR1 | D1.A 49.44,64.86 45.72,68.58 45.72,69.22 45.14,69.8 D3.A 43.76,69.85 41.27,69.85 40.26,70.87 BAT.PWR
VBUS
  Top 0.61: C1.1 46.23,44.16 IC4.1 49.18,44.16 49.53,43.81 49.53,42.55 49.25,42.26 IC4.3 | D1.C 52.02,47.71 | 52.02,47.71 R2.2 | D2.C 52.05,47.68 52.02,47.71
  Top 0.813: D1.C 47.08,47.71 46.1,46.74 C1.1

### Text on the board
Top: TOP
Bottom: BOTTOM
tPlace: Balloon / Cut-Down / V3
bPlace: Balloon / Cut-Down / V3
tNames: BOOT | CLOSE | + | - | OPEN
bNames: GND